# Altium schematic sheet Main.SchDoc
size A4; SheetNumber: 1; SheetTotal: 4
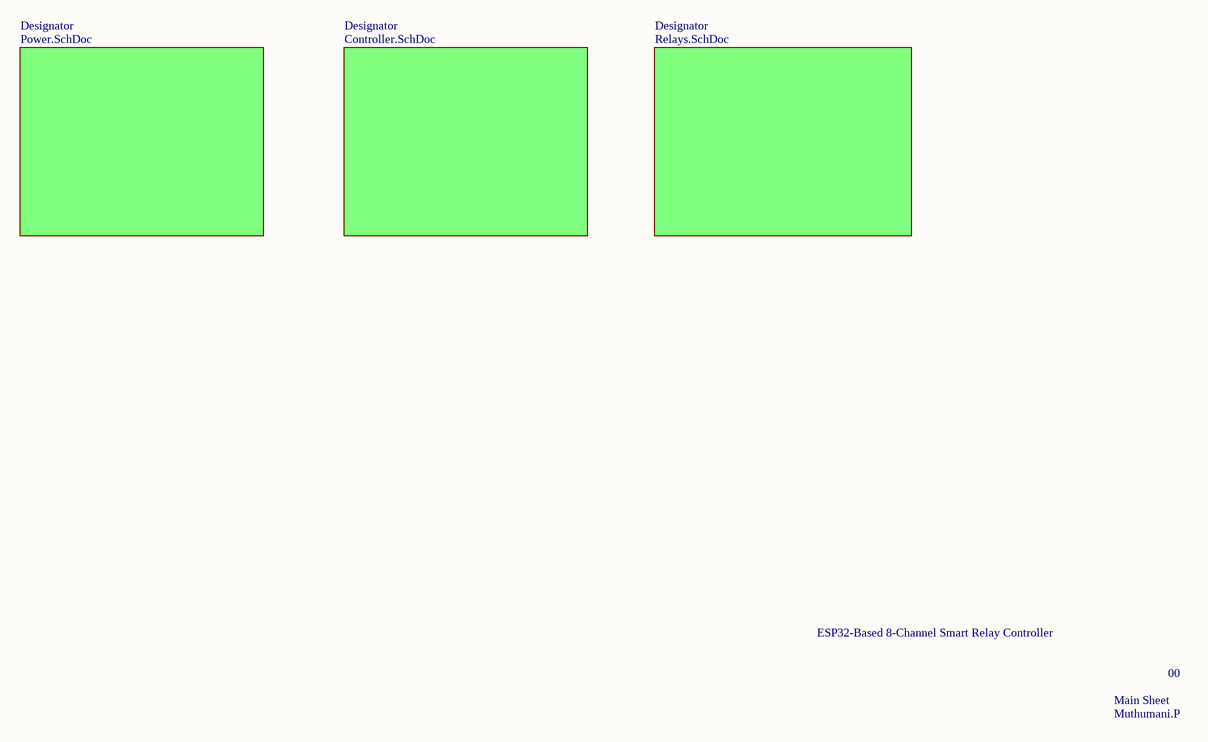
[diagram p0: Main.SchDoc]

## Sub-sheets
Designator = Power.SchDoc: no entries
Designator = Controller.SchDoc: no entries
Designator = Relays.SchDoc: no entries

## Notes on the sheet
- ESP32-Based 8-Channel Smart Relay Controller
- Main Sheet
- 00
- Muthumani.P